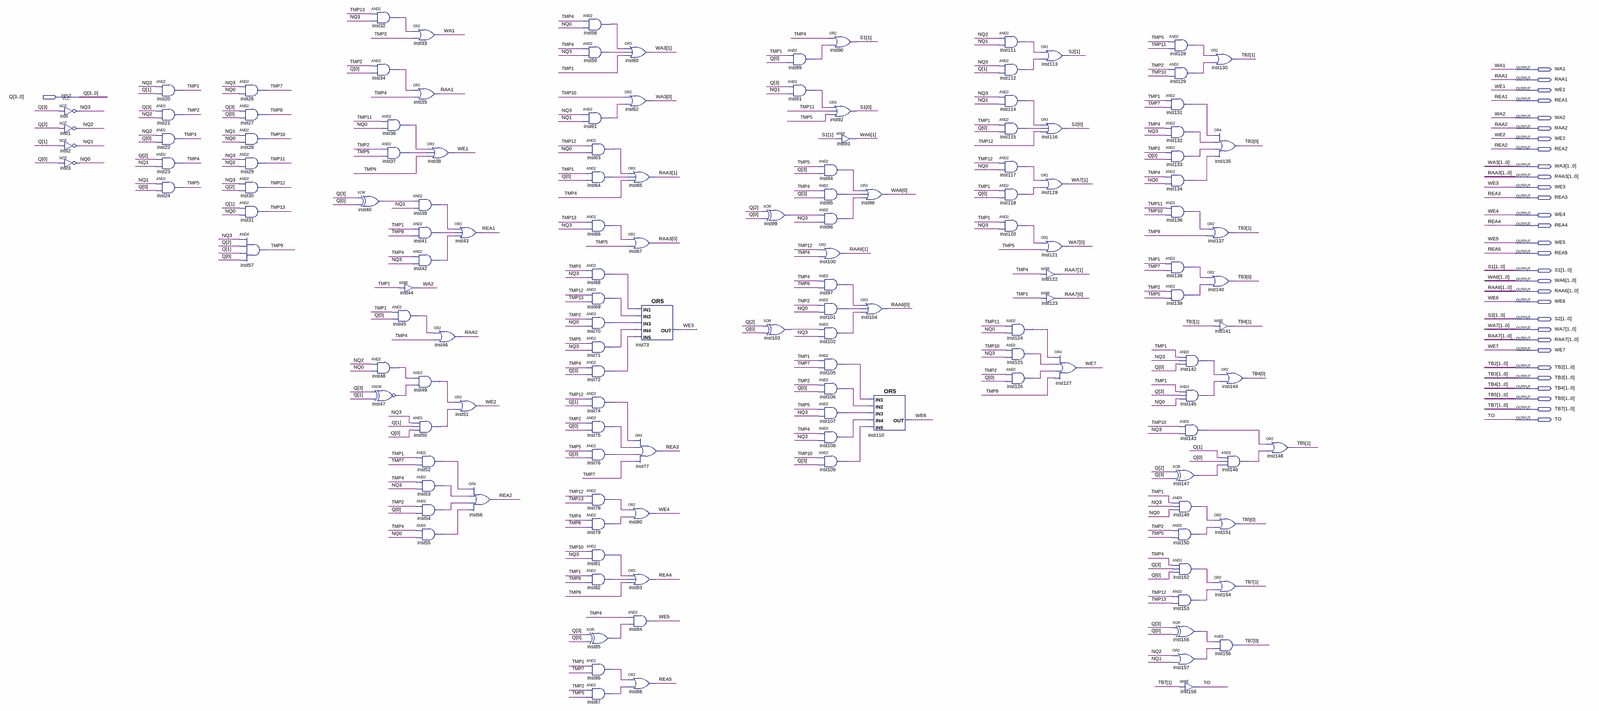
[diagram p0: schematic sheet, whole]
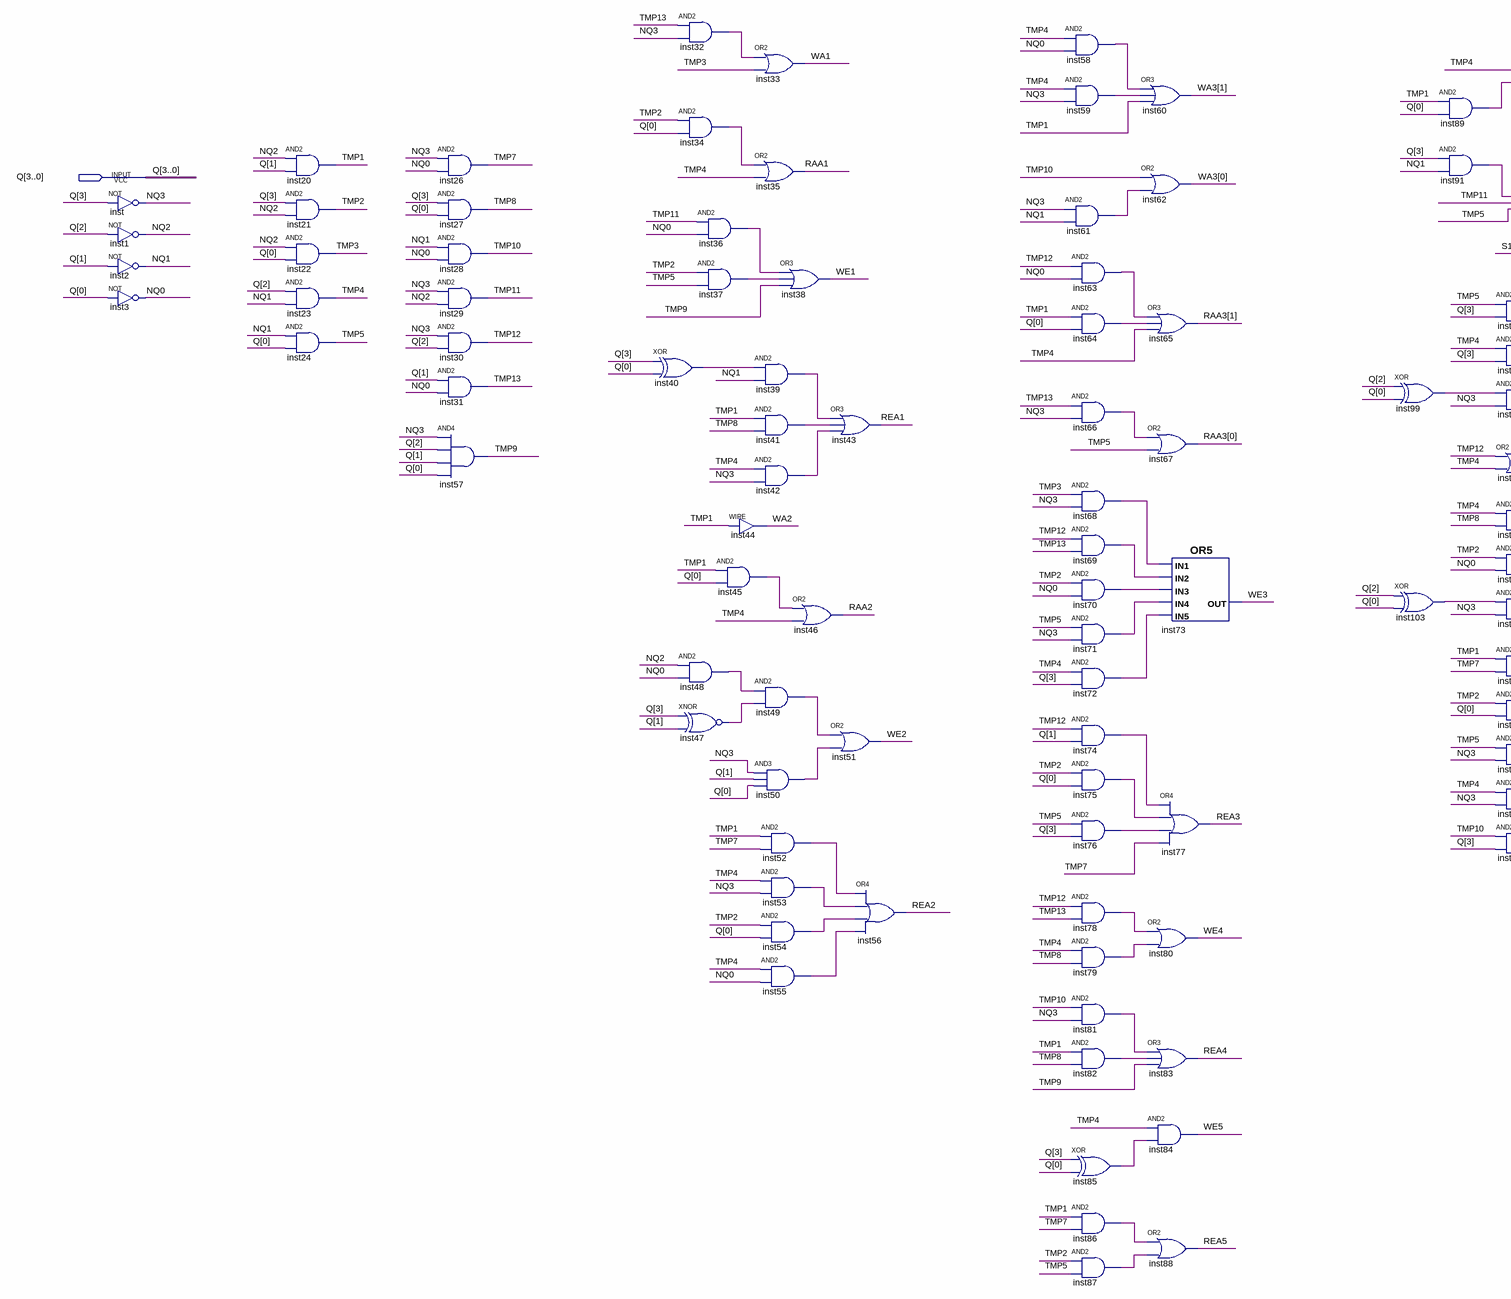
[diagram p1: schematic sheet, left part]
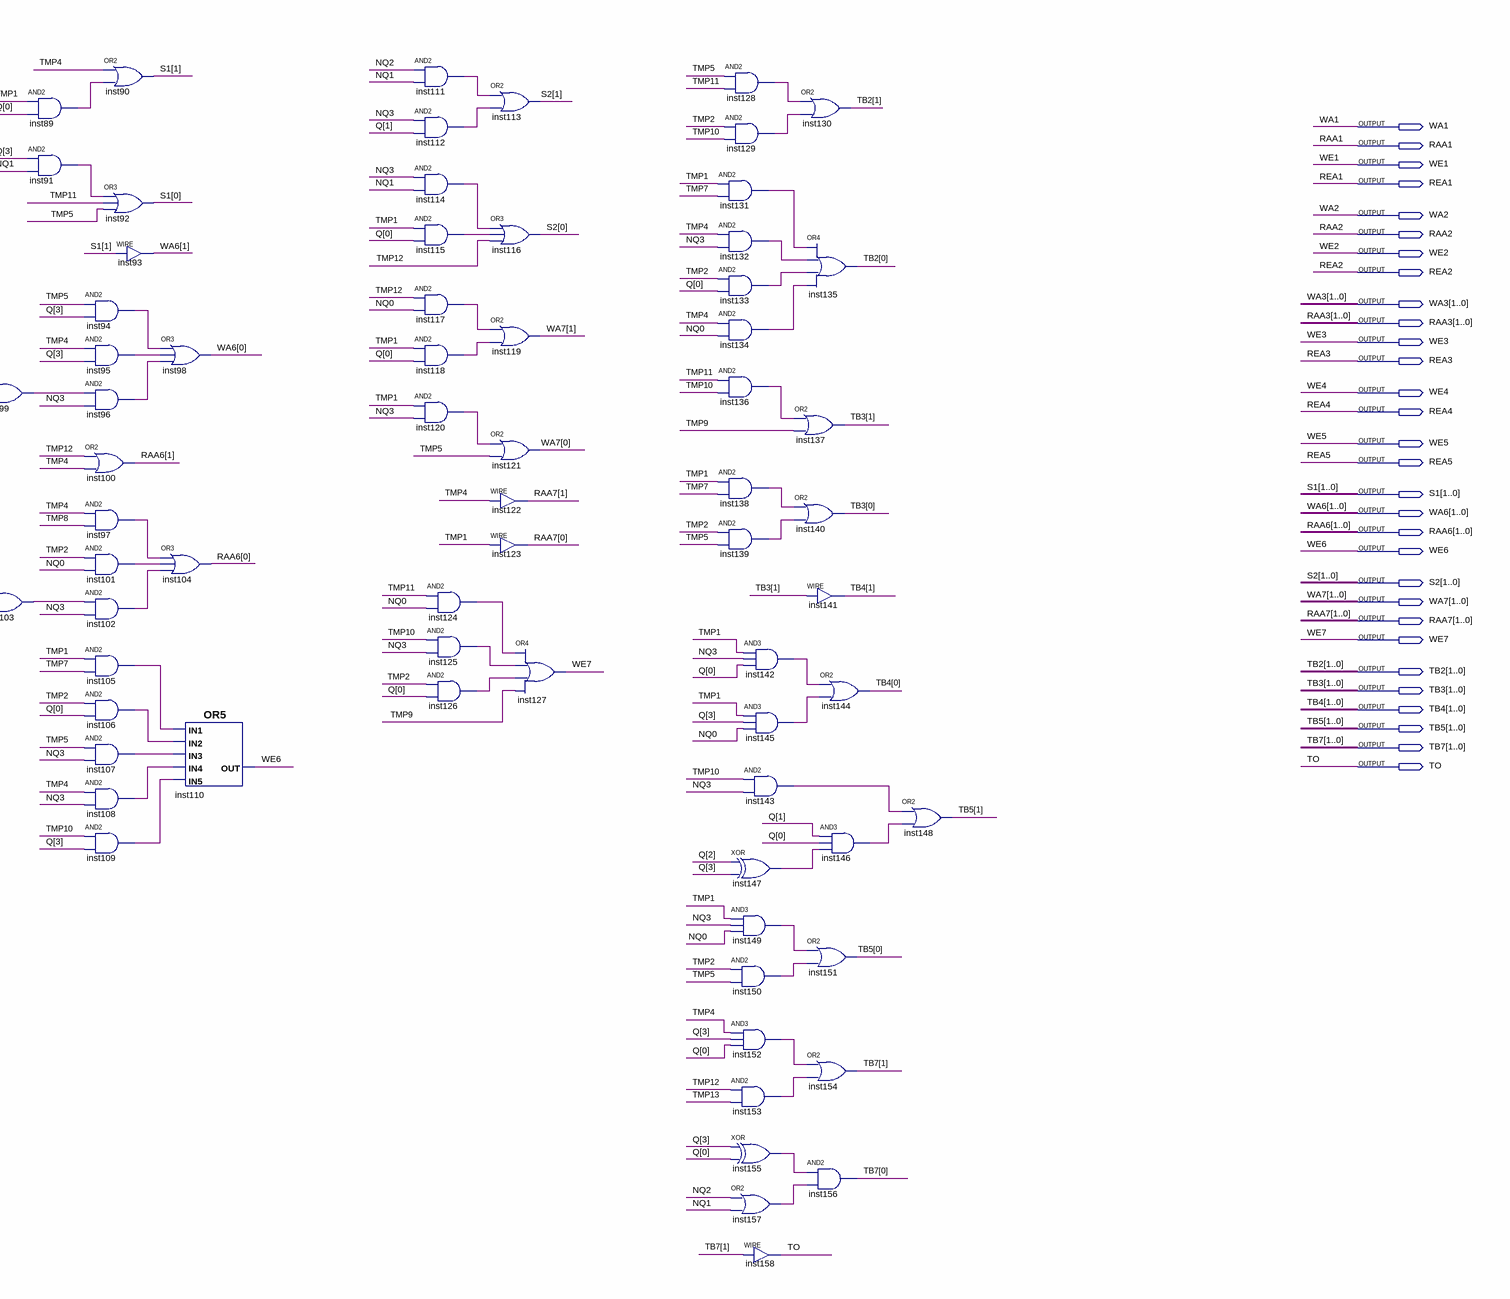
[diagram p2: schematic sheet, right part]
// Quartus schematic OutputBlock2.bdf as structural Verilog: 142 symbols, 31 pins
module OutputBlock2 (
  input  [3:0] Q,
  output WA1,
  output RAA1,
  output WE1,
  output REA1,
  output WA2,
  output RAA2,
  output WE2,
  output REA2,
  output [1:0] WA3,
  output [1:0] RAA3,
  output WE3,
  output REA3,
  output WE4,
  output REA4,
  output WE5,
  output REA5,
  output [1:0] S1,
  output [1:0] WA6,
  output [1:0] RAA6,
  output WE6,
  output [1:0] S2,
  output [1:0] WA7,
  output [1:0] RAA7,
  output WE7,
  output [1:0] TB2,
  output [1:0] TB3,
  output [1:0] TB4,
  output [1:0] TB5,
  output [1:0] TB7,
  output TO
);

  wire inst32_out, inst34_out, inst36_out, inst37_out, inst39_out, inst40_out, inst41_out, inst42_out,
       inst45_out, inst47_out, inst48_out, inst49_out, inst50_out, inst52_out, inst53_out, inst54_out,
       inst55_out, inst58_out, inst59_out, inst61_out, inst63_out, inst64_out, inst66_out, inst68_out,
       inst69_out, inst70_out, inst71_out, inst72_out, inst74_out, inst75_out, inst76_out, inst78_out,
       inst79_out, inst81_out, inst82_out, inst85_out, inst86_out, inst87_out, inst89_out, inst91_out,
       inst94_out, inst95_out, inst96_out, inst97_out, inst99_out, inst101_out, inst102_out, inst103_out,
       inst105_out, inst106_out, inst107_out, inst108_out, inst109_out, inst111_out, inst112_out,
       inst114_out, inst115_out, inst117_out, inst118_out, inst120_out, inst124_out, inst125_out,
       inst126_out, inst128_out, inst129_out, inst131_out, inst132_out, inst133_out, inst134_out,
       inst136_out, inst138_out, inst139_out, inst142_out, inst143_out, inst145_out, inst146_out,
       inst147_out, inst149_out, inst150_out, inst152_out, inst153_out, inst155_out, inst157_out, NQ0, NQ1,
       NQ2, NQ3, TMP1, TMP2, TMP3, TMP4, TMP5, TMP7, TMP8, TMP9, TMP10, TMP11, TMP12, TMP13;

  not inst (NQ3, Q[3]);
  not inst1 (NQ2, Q[2]);
  not inst2 (NQ1, Q[1]);
  not inst3 (NQ0, Q[0]);
  and inst20 (TMP1, NQ2, Q[1]);
  and inst21 (TMP2, Q[3], NQ2);
  and inst22 (TMP3, NQ2, Q[0]);
  and inst23 (TMP4, Q[2], NQ1);
  and inst24 (TMP5, NQ1, Q[0]);
  and inst26 (TMP7, NQ3, NQ0);
  and inst27 (TMP8, Q[3], Q[0]);
  and inst28 (TMP10, NQ1, NQ0);
  and inst29 (TMP11, NQ3, NQ2);
  and inst30 (TMP12, NQ3, Q[2]);
  and inst31 (TMP13, Q[1], NQ0);
  and inst57 (TMP9, NQ3, Q[2], Q[1], Q[0]);
  and inst32 (inst32_out, TMP13, NQ3);
  and inst34 (inst34_out, TMP2, Q[0]);
  xor inst40 (inst40_out, Q[3], Q[0]);
  and inst48 (inst48_out, NQ2, NQ0);
  xnor inst47 (inst47_out, Q[3], Q[1]);
  and inst36 (inst36_out, TMP11, NQ0);
  and inst37 (inst37_out, TMP2, TMP5);
  assign WA2 = TMP1;  // WIRE inst44
  and inst45 (inst45_out, TMP1, Q[0]);
  or inst33 (WA1, inst32_out, TMP3);
  or inst35 (RAA1, inst34_out, TMP4);
  or inst38 (WE1, inst36_out, inst37_out, TMP9);
  and inst39 (inst39_out, inst40_out, NQ1);
  and inst41 (inst41_out, TMP1, TMP8);
  and inst42 (inst42_out, TMP4, NQ3);
  and inst49 (inst49_out, inst48_out, inst47_out);
  and inst50 (inst50_out, NQ3, Q[1], Q[0]);
  and inst52 (inst52_out, TMP1, TMP7);
  and inst53 (inst53_out, TMP4, NQ3);
  and inst54 (inst54_out, TMP2, Q[0]);
  and inst55 (inst55_out, TMP4, NQ0);
  or inst43 (REA1, inst39_out, inst41_out, inst42_out);
  or inst46 (RAA2, inst45_out, TMP4);
  or inst51 (WE2, inst49_out, inst50_out);
  or inst56 (REA2, inst52_out, inst53_out, inst54_out, inst55_out);
  and inst58 (inst58_out, TMP4, NQ0);
  and inst59 (inst59_out, TMP4, NQ3);
  and inst61 (inst61_out, NQ3, NQ1);
  and inst63 (inst63_out, TMP12, NQ0);
  and inst64 (inst64_out, TMP1, Q[0]);
  and inst66 (inst66_out, TMP13, NQ3);
  and inst68 (inst68_out, TMP3, NQ3);
  and inst69 (inst69_out, TMP12, TMP13);
  and inst70 (inst70_out, TMP2, NQ0);
  and inst71 (inst71_out, TMP5, NQ3);
  and inst72 (inst72_out, TMP4, Q[3]);
  and inst74 (inst74_out, TMP12, Q[1]);
  and inst75 (inst75_out, TMP2, Q[0]);
  and inst76 (inst76_out, TMP5, Q[3]);
  and inst78 (inst78_out, TMP12, TMP13);
  and inst79 (inst79_out, TMP4, TMP8);
  and inst81 (inst81_out, TMP10, NQ3);
  and inst82 (inst82_out, TMP1, TMP8);
  xor inst85 (inst85_out, Q[3], Q[0]);
  and inst86 (inst86_out, TMP1, TMP7);
  and inst87 (inst87_out, TMP2, TMP5);
  or inst60 (WA3[1], inst58_out, inst59_out, TMP1);
  or inst62 (WA3[0], TMP10, inst61_out);
  or inst65 (RAA3[1], inst63_out, inst64_out, TMP4);
  or inst67 (RAA3[0], inst66_out, TMP5);
  or inst73 (WE3, inst68_out, inst69_out, inst70_out, inst71_out, inst72_out);
  or inst77 (REA3, inst74_out, inst75_out, inst76_out, TMP7);
  or inst80 (WE4, inst78_out, inst79_out);
  or inst83 (REA4, inst81_out, inst82_out, TMP9);
  and inst84 (WE5, TMP4, inst85_out);
  or inst88 (REA5, inst86_out, inst87_out);
  and inst89 (inst89_out, TMP1, Q[0]);
  and inst91 (inst91_out, Q[3], NQ1);
  xor inst99 (inst99_out, Q[2], Q[0]);
  xor inst103 (inst103_out, Q[2], Q[0]);
  or inst90 (S1[1], TMP4, inst89_out);
  or inst92 (S1[0], inst91_out, TMP11, TMP5);
  assign WA6[1] = S1[1];  // WIRE inst93
  and inst94 (inst94_out, TMP5, Q[3]);
  and inst95 (inst95_out, TMP4, Q[3]);
  and inst96 (inst96_out, inst99_out, NQ3);
  or inst100 (RAA6[1], TMP12, TMP4);
  and inst97 (inst97_out, TMP4, TMP8);
  and inst101 (inst101_out, TMP2, NQ0);
  and inst102 (inst102_out, inst103_out, NQ3);
  and inst105 (inst105_out, TMP1, TMP7);
  and inst106 (inst106_out, TMP2, Q[0]);
  and inst107 (inst107_out, TMP5, NQ3);
  and inst108 (inst108_out, TMP4, NQ3);
  and inst109 (inst109_out, TMP10, Q[3]);
  or inst98 (WA6[0], inst94_out, inst95_out, inst96_out);
  or inst104 (RAA6[0], inst97_out, inst101_out, inst102_out);
  or inst110 (WE6, inst105_out, inst106_out, inst107_out, inst108_out, inst109_out);
  and inst111 (inst111_out, NQ2, NQ1);
  and inst112 (inst112_out, NQ3, Q[1]);
  and inst114 (inst114_out, NQ3, NQ1);
  and inst115 (inst115_out, TMP1, Q[0]);
  and inst117 (inst117_out, TMP12, NQ0);
  and inst118 (inst118_out, TMP1, Q[0]);
  and inst120 (inst120_out, TMP1, NQ3);
  and inst124 (inst124_out, TMP11, NQ0);
  and inst125 (inst125_out, TMP10, NQ3);
  and inst126 (inst126_out, TMP2, Q[0]);
  or inst113 (S2[1], inst111_out, inst112_out);
  or inst116 (S2[0], inst114_out, inst115_out, TMP12);
  or inst119 (WA7[1], inst117_out, inst118_out);
  or inst121 (WA7[0], inst120_out, TMP5);
  assign RAA7[1] = TMP4;  // WIRE inst122
  assign RAA7[0] = TMP1;  // WIRE inst123
  or inst127 (WE7, inst124_out, inst125_out, inst126_out, TMP9);
  and inst128 (inst128_out, TMP5, TMP11);
  and inst129 (inst129_out, TMP2, TMP10);
  and inst131 (inst131_out, TMP1, TMP7);
  and inst132 (inst132_out, TMP4, NQ3);
  and inst133 (inst133_out, TMP2, Q[0]);
  and inst134 (inst134_out, TMP4, NQ0);
  and inst136 (inst136_out, TMP11, TMP10);
  and inst138 (inst138_out, TMP1, TMP7);
  and inst139 (inst139_out, TMP2, TMP5);
  xor inst147 (inst147_out, Q[2], Q[3]);
  and inst149 (inst149_out, TMP1, NQ3, NQ0);
  and inst150 (inst150_out, TMP2, TMP5);
  and inst152 (inst152_out, TMP4, Q[3], Q[0]);
  and inst153 (inst153_out, TMP12, TMP13);
  xor inst155 (inst155_out, Q[3], Q[0]);
  or inst157 (inst157_out, NQ2, NQ1);
  and inst142 (inst142_out, TMP1, NQ3, Q[0]);
  and inst145 (inst145_out, TMP1, Q[3], NQ0);
  and inst143 (inst143_out, TMP10, NQ3);
  assign TO = TB7[1];  // WIRE inst158
  or inst130 (TB2[1], inst128_out, inst129_out);
  or inst135 (TB2[0], inst131_out, inst132_out, inst133_out, inst134_out);
  or inst137 (TB3[1], inst136_out, TMP9);
  or inst140 (TB3[0], inst138_out, inst139_out);
  assign TB4[1] = TB3[1];  // WIRE inst141
  or inst144 (TB4[0], inst142_out, inst145_out);
  and inst146 (inst146_out, Q[1], Q[0], inst147_out);
  or inst151 (TB5[0], inst149_out, inst150_out);
  or inst154 (TB7[1], inst152_out, inst153_out);
  and inst156 (TB7[0], inst155_out, inst157_out);
  or inst148 (TB5[1], inst143_out, inst146_out);
endmodule
